# Altium schematic sheet Power_Top.SchDoc: Power Top
size A3; Organization: Hofmann Travel; SheetNumber: 6; SheetTotal: 10
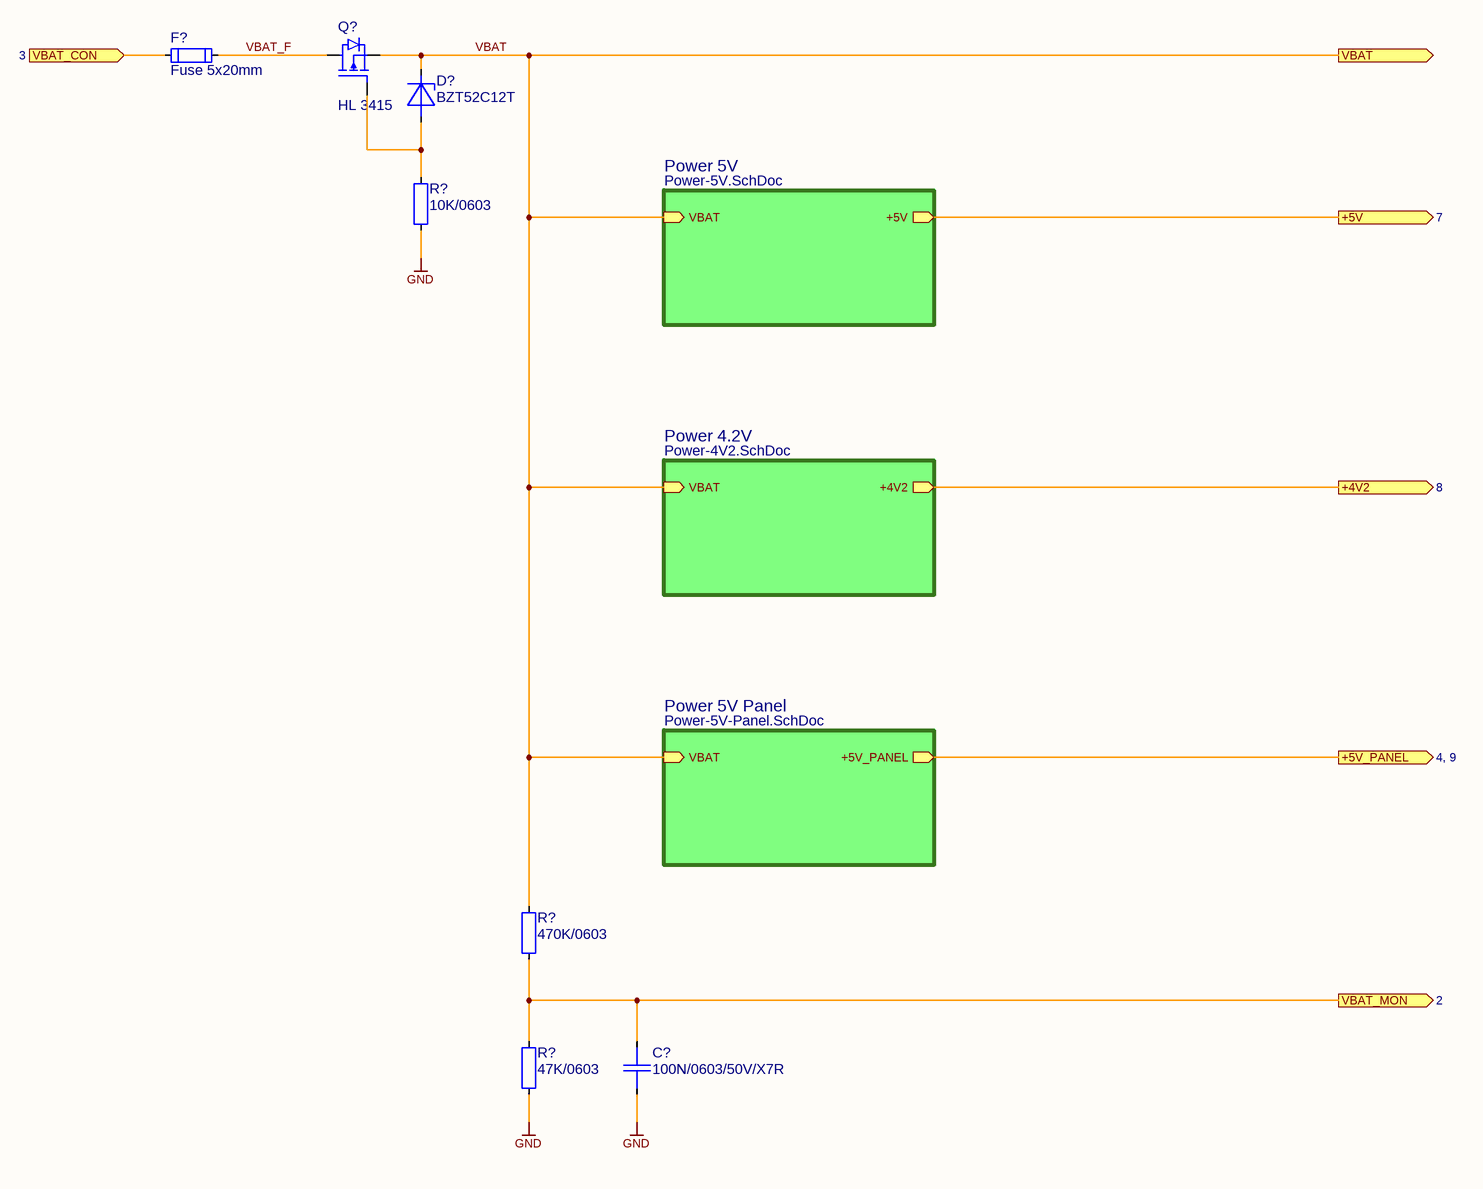
[diagram p0: Power_Top.SchDoc]

## Parts
(Parts that share a designator on the sheet are numbered #1, #2 ... from top to bottom, then left to right.)
C?  100N/0603/50V/X7R  [CAP0603_X7R]
D?  BZT52C12T  [SOD1608X065]
F?  Fuse 5x20mm  [OGN_THR]
Q?  HL 3415  [SOT2395P280X125-3-SE]
R?#1  10K/0603  [R0603-0.40-WW]
R?#2  470K/0603  [R0603-0.40-WW]
R?#3  47K/0603  [R0603-0.40-WW]

## Sub-sheets
Power 4.2V = Power-4V2.SchDoc: VBAT (in), +4V2 (out)
Power 5V = Power-5V.SchDoc: VBAT (in), +5V (out)
Power 5V Panel = Power-5V-Panel.SchDoc: VBAT (in), +5V_PANEL (out)

## Ports
+4V2 (out, see 8), +5V (out, see 7), +5V_PANEL (out, see 4, 9), VBAT (out), VBAT_CON (in, see 3), VBAT_MON (out, see 2)

## Nets
GND: C?.2 R?#1.2 R?#3.2
+4V2: port +4V2, sheet Power 4.2V/+4V2
+5V: port +5V, sheet Power 5V/+5V
+5V_PANEL: port +5V_PANEL, sheet Power 5V Panel/+5V_PANEL
VBAT: D?.1 Q?.2(SOURCE) R?#2.1 ; port VBAT, sheet Power 5V/VBAT, sheet Power 4.2V/VBAT, sheet Power 5V Panel/VBAT
VBAT_CON: F?.1 ; port VBAT_CON
VBAT_F: F?.2 Q?.3(DRAIN)
VBAT_MON: C?.1 R?#2.2 R?#3.1 ; port VBAT_MON
NetD?_2: D?.2 Q?.1(GATE) R?#1.1

## Notes on the sheet
- Date:
- Size:
- A3
- Schema:
- Layout:

## Library data of the parts
C? = 100N/0603/50V/X7R: CAP SM 0603 100nF 50V X7R; Manufacturer: GENERIC; Manufacturer 1: YAGEO; Manufacturer Part Number 1: CC0603KPX7R9BB104; Absolute Value: 1E-7; Eurocircuits GPN: GPC0603104; Part Number: 100N/0603/50V/X7R; Package: 0603; Value: 100nF; HelpURL: https://www.yageo.com/upload/media/product/app/datasheet/mlcc/upy-gphc_x7r_6_3v-to-250v.pdf; Supplier 1: Digi-Key; Supplier Part Number 1: 311-3567-1-ND; Manufacturer 2: YAGEO; Manufacturer Part Number 2: CC0603MRX7R9BB104; Supplier 2: Digi-Key; Supplier Part Number 2: 311-4110-1-ND; Supplier 3: LCSC; Supplier Part Number 3: C14663; JLC Type: Basic
D? = BZT52C12T: DIODE ZENER 12V 100MW SOD523; Manufacturer: Micro Commercial Co; Manufacturer Part Number 1: BZT52C12T-TP; Part Number: BZT52C12T; Package: SC-79, SOD-523; Value: BZT52C12T; Absolute Value: 12 V; HelpURL: https://www.mccsemi.com/pdf/Products/BZT52C(B)2V4T-BZT52C(B)39T(SOD-523).pdf; Manufacturer 1: Micro Commercial Co; Supplier 1: Digikey; Supplier Part Number 1: BZT52C12T-TPMSCT-ND; Manufacturer 2: Diodes Incorporated; Manufacturer Part Number 2: BZT52C12T-7; Supplier 2: Digikey; Supplier Part Number 2: BZT52C12T-7DICT-ND
F? = Fuse/5x20mm/OGN: open fuse holder, 5 x 20 mm, THR, IEC 60335-1; Manufacturer: Schurter; Manufacturer Part Number 1: 3-132-873; Part Number: Fuse/5x20mm/OGN; Package: 5X20; HelpURL: https://www.schurter.com/en/datasheet/typ_OGN.pdf; Manufacturer 1: Schurter; Supplier 1: Digi-Key; Supplier Part Number 1: 486-3-132-873-ND
Q? = HL 3415: P-CH 20V Fast Switching MOSFETs; Manufacturer: GENERIC; Part Number: HL 3415; Package: SOT23; HelpURL: https://datasheet.lcsc.com/lcsc/2306211455_HL-3415_C7431444.pdf; Manufacturer 3: HL; Manufacturer Part Number 3: HL 3415; Supplier 3: LCSC; Supplier Part Number 3: C7431444
R?#1 = 10K/0603: RES SM 0603 10K; Manufacturer: GENERIC; Manufacturer 1: YAGEO; Manufacturer Part Number 1: RC0603FR-1310KL; Absolute Value: 10000; Eurocircuits GPN: GPR060310K; Part Number: 10K/0603; Package: 0603; Value: 10K; HelpURL: https://www.yageo.com/upload/media/product/productsearch/datasheet/rchip/PYu-RC_Group_51_RoHS_L_12.pdf; Supplier 1: Digi-Key; Supplier Part Number 1: 13-RC0603FR-1310KLCT-ND; Manufacturer 2: YAGEO; Manufacturer Part Number 2: RC0603FR-1010KL; Supplier 2: Digi-Key; Supplier Part Number 2: 13-RC0603FR-1010KLCT-ND; Manufacturer 3: UNI-ROYAL(Uniroyal Elec); Manufacturer Part Number 3: 0603WAF1002T5E; Supplier 3: LCSC; Supplier Part Number 3: C25804; JLC Type: Basic
R?#2 = 470K/0603: RES SM 0603 470K; Manufacturer: GENERIC; Manufacturer 1: YAGEO; Manufacturer Part Number 1: RC0603FR-13470KL; Absolute Value: 470000; Eurocircuits GPN: GPR0603470K; Part Number: 470K/0603; Package: 0603; Value: 470K; HelpURL: https://www.yageo.com/upload/media/product/app/datasheet/rchip/pyu-rc_group_51_rohs_l.pdf; Supplier 1: Digi-Key; Supplier Part Number 1: 13-RC0603FR-13470KLCT-ND; Manufacturer 2: YAGEO; Manufacturer Part Number 2: RC0603FR-10470KL; Supplier 2: Digi-Key; Supplier Part Number 2: 13-RC0603FR-10470KLCT-ND
R?#3 = 47K/0603: RES SM 0603 47K; Manufacturer: GENERIC; Manufacturer 1: YAGEO; Manufacturer Part Number 1: RC0603FR-1347KL; Absolute Value: 47000; Eurocircuits GPN: GPR060347K; Part Number: 47K/0603; Package: 0603; Value: 47K; HelpURL: https://www.yageo.com/upload/media/product/app/datasheet/rchip/pyu-rc_group_51_rohs_l.pdf; Supplier 1: Digi-Key; Supplier Part Number 1: 13-RC0603FR-1347KLCT-ND; Manufacturer 2: YAGEO; Manufacturer Part Number 2: RC0603FR-1047KL; Supplier 2: Digi-Key; Supplier Part Number 2: 13-RC0603FR-1047KLCT-ND; Manufacturer 3: UNI-ROYAL(Uniroyal Elec); Manufacturer Part Number 3: 0603WAF4702T5E; Supplier 3: LCSC; Supplier Part Number 3: C25819; JLC Type: Basic